# EAGLE design Felderblock_Hebelplatine (EAGLE 7.7.0)
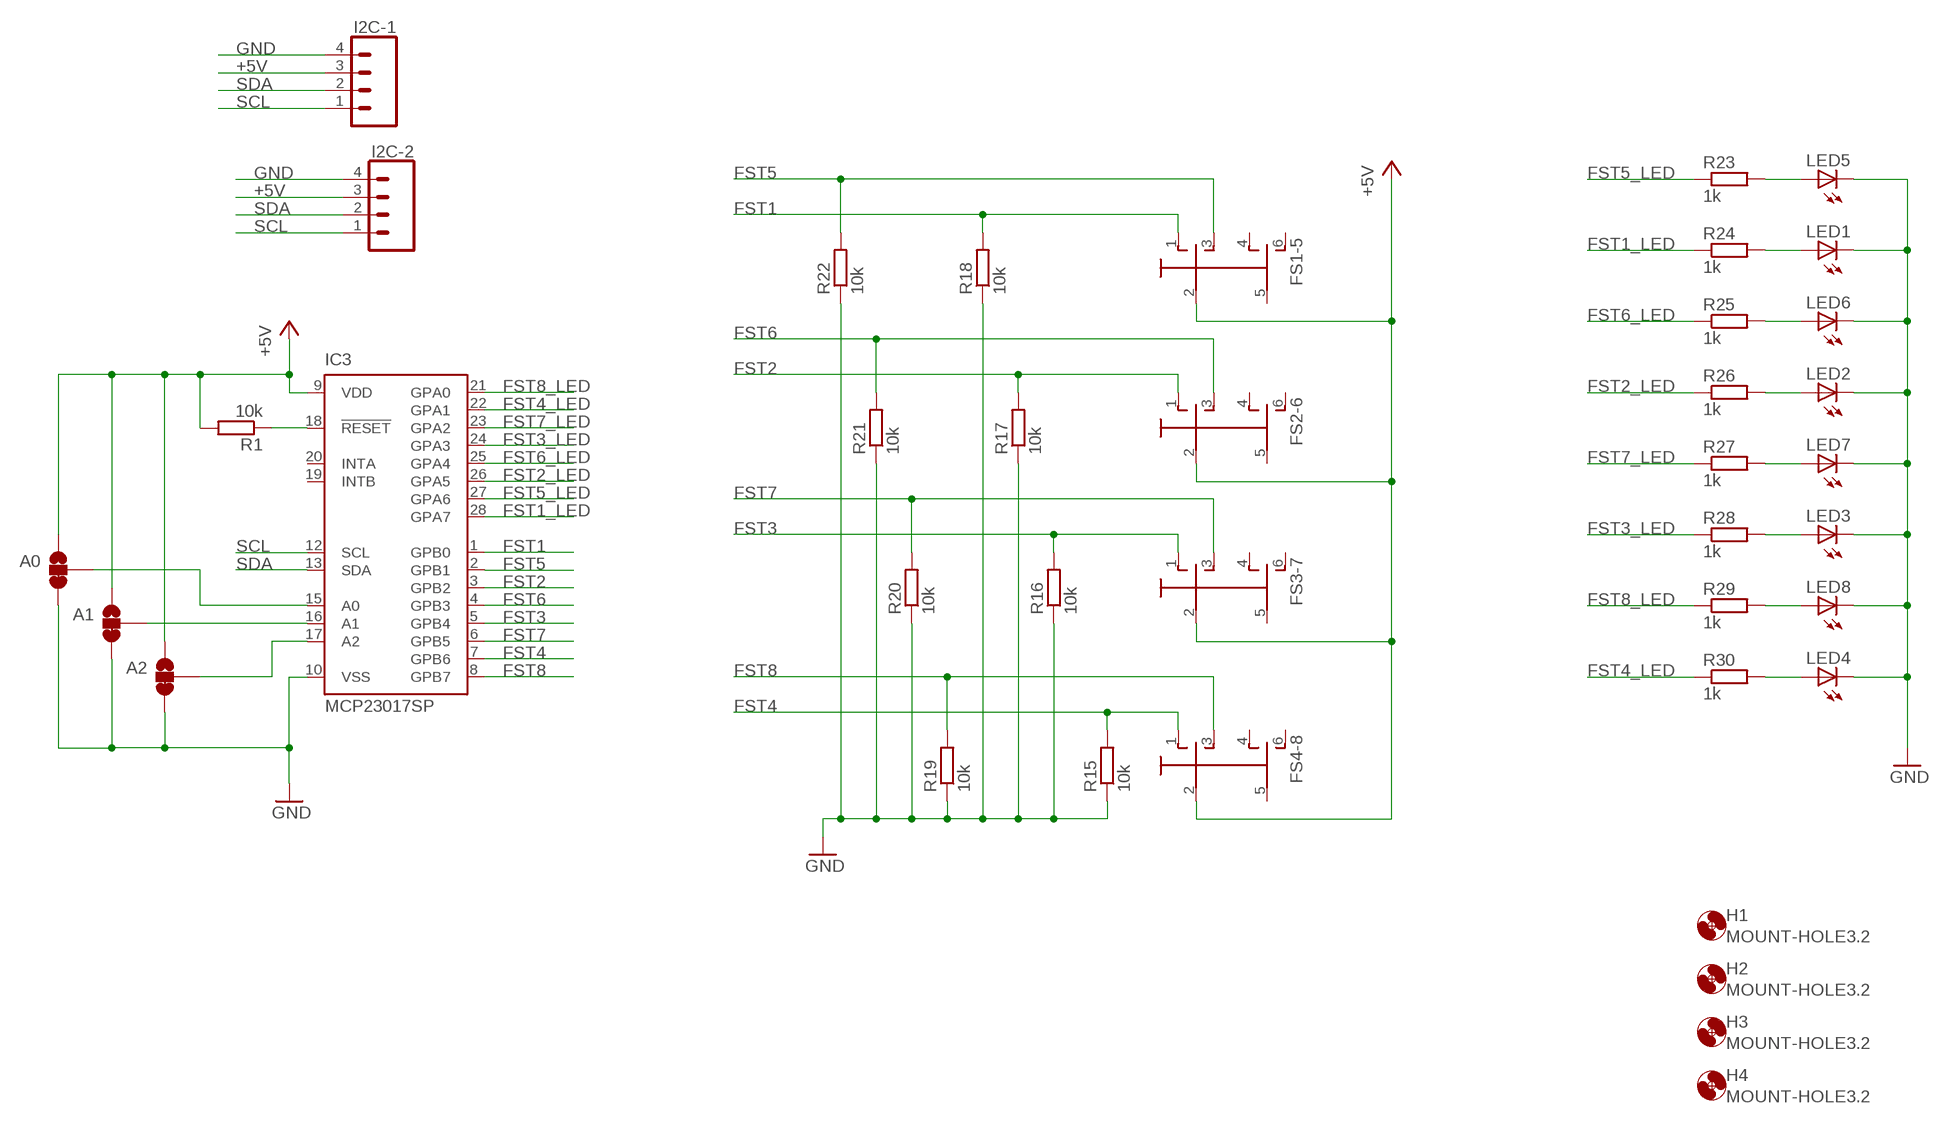
[diagram p0: schematic, sheet 1]

## Parts
A0  JUMPER-SMT_3_1-NC_TRACE_SILK  [SMT-JUMPER_3_1-NC_TRACE_SILK]
A1  JUMPER-SMT_3_1-NC_TRACE_SILK  [SMT-JUMPER_3_1-NC_TRACE_SILK]
A2  JUMPER-SMT_3_1-NC_TRACE_SILK  [SMT-JUMPER_3_1-NC_TRACE_SILK]
FS1-5  SW_2POL_ON-OFF-ONSOLDERPAD  [DIL6_LARGE]
FS2-6  SW_2POL_ON-OFF-ONSOLDERPAD  [DIL6_LARGE]
FS3-7  SW_2POL_ON-OFF-ONSOLDERPAD  [DIL6_LARGE]
FS4-8  SW_2POL_ON-OFF-ONSOLDERPAD  [DIL6_LARGE]
H1  MOUNT-HOLE3.2  [3,2]
H2  MOUNT-HOLE3.2  [3,2]
H3  MOUNT-HOLE3.2  [3,2]
H4  MOUNT-HOLE3.2  [3,2]
I2C-1  CONN_04JST-PTH-VERT  [JST-4-PTH-VERT]
I2C-2  CONN_04JST-PTH-VERT  [JST-4-PTH-VERT]
IC3  MCP23017SP  [DIL28-3]
LED1  LED3MM  [LED3MM]
LED2  LED3MM  [LED3MM]
LED3  LED3MM  [LED3MM]
LED4  LED3MM  [LED3MM]
LED5  LED3MM  [LED3MM]
LED6  LED3MM  [LED3MM]
LED7  LED3MM  [LED3MM]
LED8  LED3MM  [LED3MM]
R1  10k  R-EU_0207/7  [0207/7]
R15  10k  R-EU_0207/7  [0207/7]
R16  10k  R-EU_0207/7  [0207/7]
R17  10k  R-EU_0207/7  [0207/7]
R18  10k  R-EU_0207/7  [0207/7]
R19  10k  R-EU_0207/7  [0207/7]
R20  10k  R-EU_0207/7  [0207/7]
R21  10k  R-EU_0207/7  [0207/7]
R22  10k  R-EU_0207/7  [0207/7]
R23  1k  R-EU_0207/7  [0207/7]
R24  1k  R-EU_0207/7  [0207/7]
R25  1k  R-EU_0207/7  [0207/7]
R26  1k  R-EU_0207/7  [0207/7]
R27  1k  R-EU_0207/7  [0207/7]
R28  1k  R-EU_0207/7  [0207/7]
R29  1k  R-EU_0207/7  [0207/7]
R30  1k  R-EU_0207/7  [0207/7]

## Nets
+5V: A0.1 A1.1 A2.1 FS1-5.2(P) FS2-6.2(P) FS3-7.2(P) FS4-8.2(P) I2C-1.3 I2C-2.3 IC3.9(VDD) R1.2
FST1: FS1-5.1(O) IC3.1(GPB0) R18.2
FST1_LED: IC3.28(GPA7) R24.1
FST2: FS2-6.1(O) IC3.3(GPB2) R17.2
FST2_LED: IC3.26(GPA5) R26.1
FST3: FS3-7.1(O) IC3.5(GPB4) R16.2
FST3_LED: IC3.24(GPA3) R28.1
FST4: FS4-8.1(O) IC3.7(GPB6) R15.2
FST4_LED: IC3.22(GPA1) R30.1
FST5: FS1-5.3(S) IC3.2(GPB1) R22.2
FST5_LED: IC3.27(GPA6) R23.1
FST6: FS2-6.3(S) IC3.4(GPB3) R21.2
FST6_LED: IC3.25(GPA4) R25.1
FST7: FS3-7.3(S) IC3.6(GPB5) R20.2
FST7_LED: IC3.23(GPA2) R27.1
FST8: FS4-8.3(S) IC3.8(GPB7) R19.2
FST8_LED: IC3.21(GPA0) R29.1
GND: A0.3 A1.3 A2.3 I2C-1.4 I2C-2.4 IC3.10(VSS) LED1.K(C) LED2.K(C) LED3.K(C) LED4.K(C) LED5.K(C) LED6.K(C) LED7.K(C) LED8.K(C) R15.1 R16.1 R17.1 R18.1 R19.1 R20.1 R21.1 R22.1
N$1: A0.2 IC3.15(A0)
N$2: A2.2 IC3.17(A2)
N$3: A1.2 IC3.16(A1)
N$4: IC3.18(!RESET) R1.1
N$10: LED5.A R23.2
N$11: LED1.A R24.2
N$12: LED6.A R25.2
N$13: LED2.A R26.2
N$14: LED7.A R27.2
N$15: LED3.A R28.2
N$16: LED8.A R29.2
N$17: LED4.A R30.2
SCL: I2C-1.1 I2C-2.1 IC3.12(SCL)
SDA: I2C-1.2 I2C-2.2 IC3.13(SDA)
Unconnected: FS1-5.4(O1) FS1-5.5(P1) FS1-5.6(S1) FS2-6.4(O1) FS2-6.5(P1) FS2-6.6(S1) FS3-7.4(O1) FS3-7.5(P1) FS3-7.6(S1) FS4-8.4(O1) FS4-8.5(P1) FS4-8.6(S1) IC3.19(INTB) IC3.20(INTA)

## Library data of the parts
A0 A1 A2 = SparkFun-Jumpers:JUMPER-SMT_3_1-NC_TRACE: Normally closed trace jumper (1 of 2 connections) This jumper has a trace between two pads so it's normally closed (NC). The other connection is normally open (NO). Use a razor knife to open the connection. For best results follow the IPC guidelines for cutting traces: Cutout at least 0.063 mm (0.005 in). Remove all loose material to clean up the cut area. Seal the cut with an approved epoxy. Reapply solder to reclose the connection, or to close the NO connection.
FS1-5 FS2-6 FS3-7 FS4-8 = Jens:SW_2POL_ON-OFF-ON: 2poliger Umschalter mit Mittelstellung (on-off-on)
H1-H4 = holes:MOUNT-HOLE: MOUNTING HOLE with drill center marker
I2C-1 I2C-2 = SparkFun-Connectors:CONN_04: Multi connection point. Often used as Generic Header-pin footprint for 0.1 inch spaced/style header connections On any of the 0.1 inch spaced packages, you can populate with these: Break Away Headers - Straight <https://www.sparkfun.com/products/116> (PRT-00116) Break Away Male Headers - Right Angle <https://www.sparkfun.com/products/553> (PRT-00553) Female Headers <https://www.sparkfun.com/products/115> (PRT-00115) Break Away Headers - Machine Pin <https://www.sparkfun.com/products/117> (PRT-00117) Break Away Female Headers - Swiss Machine Pin <https://www.sparkfun.com/products/743> (PRT-00743) For SCREWTERMINALS and SPRING TERMINALS visit here: Screw Terimnals on SparkFun.com <https://www.sparkfun.com/search/results?term=Screw+Terminals> (5mm/3.5mm/2.54mm spacing) This device is also useful as a general connection point to wire up your design to another part of your project. Our various solder wires solder well into these plated through hole pads. Hook-Up Wire - Assortment (Stranded, 22 AWG) <https://www.sparkfun.com/products/11375> (PRT-11375) Hook-Up Wire - Assortment (Solid Core, 22 AWG) <https://www.sparkfun.com/products/11367> (PRT-11367) View the entire wire category on our website here <https://www.sparkfun.com/categories/141> Special notes: Molex polarized connector foot print use with SKU : PRT-08231 with associated crimp pins and housings. 1MM SMD Version SKU: PRT-10208; PROD_ID: CONN-13251
IC3 = microchip:MCP23017: http://ww1.microchip.com/downloads/en/DeviceDoc/21952a.pdf Source: http://ww1.microchip.com/downloads/en/DeviceDoc/21952a.pdf; MF: MICROCHIP; MPN: MCP23017-E/SP; OC_FARNELL: 1332088; OC_NEWARK: 31K2959
LED1-LED8 = SparkFun-LED:LED: LEDs Standard schematic elements and footprints for 5mm, 3mm, 1206, and 0603 sized LEDs. 5mm - Spark Fun Electronics SKU : COM-00529 (and others)
R1 R15-R30 = resistor:R-EU_: RESISTOR, European symbol

## Board
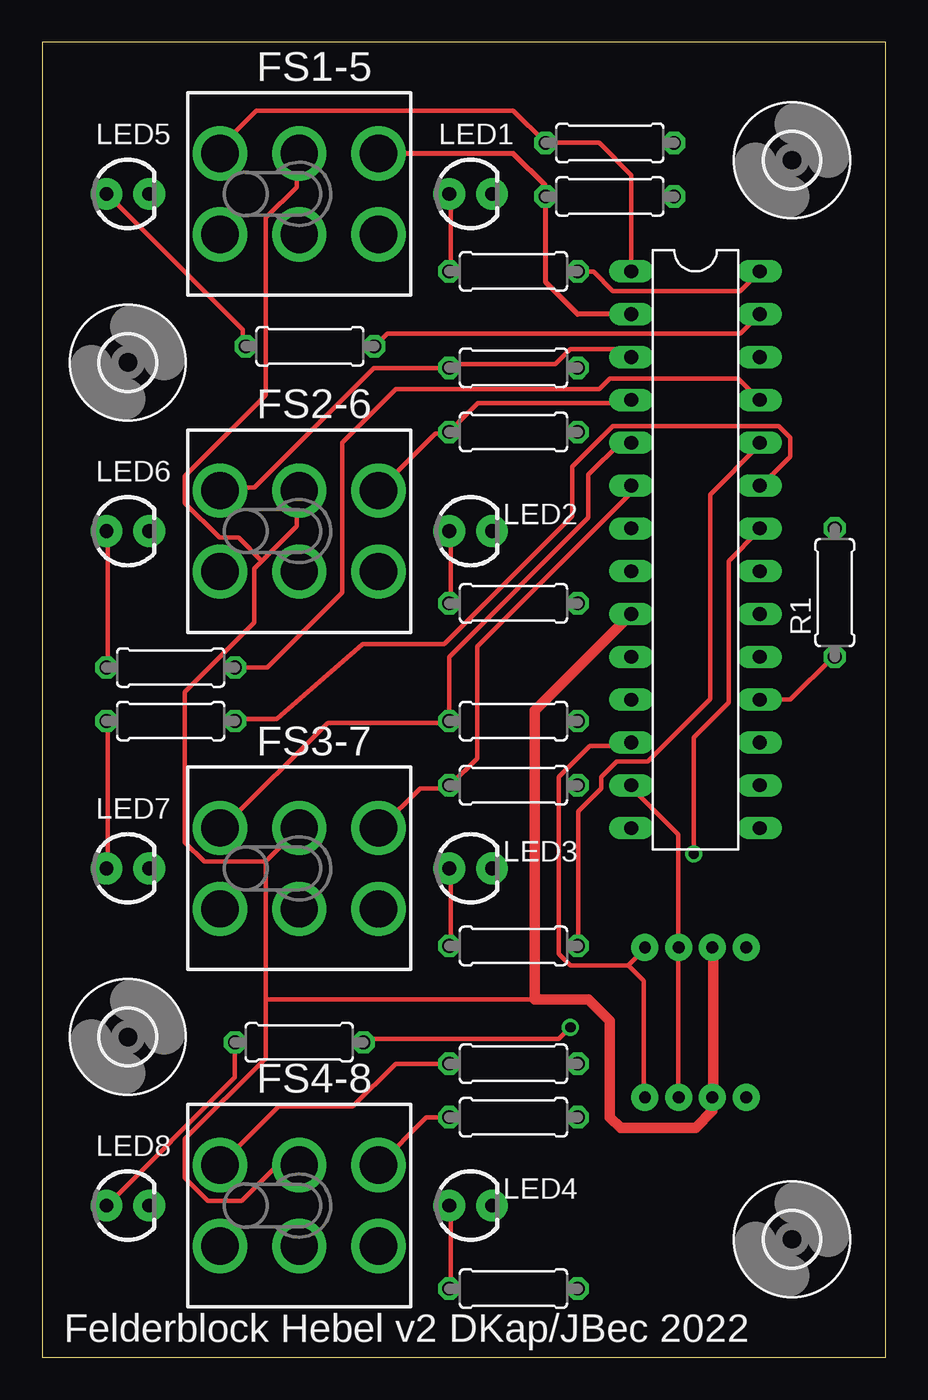
[diagram p1: board, top side]
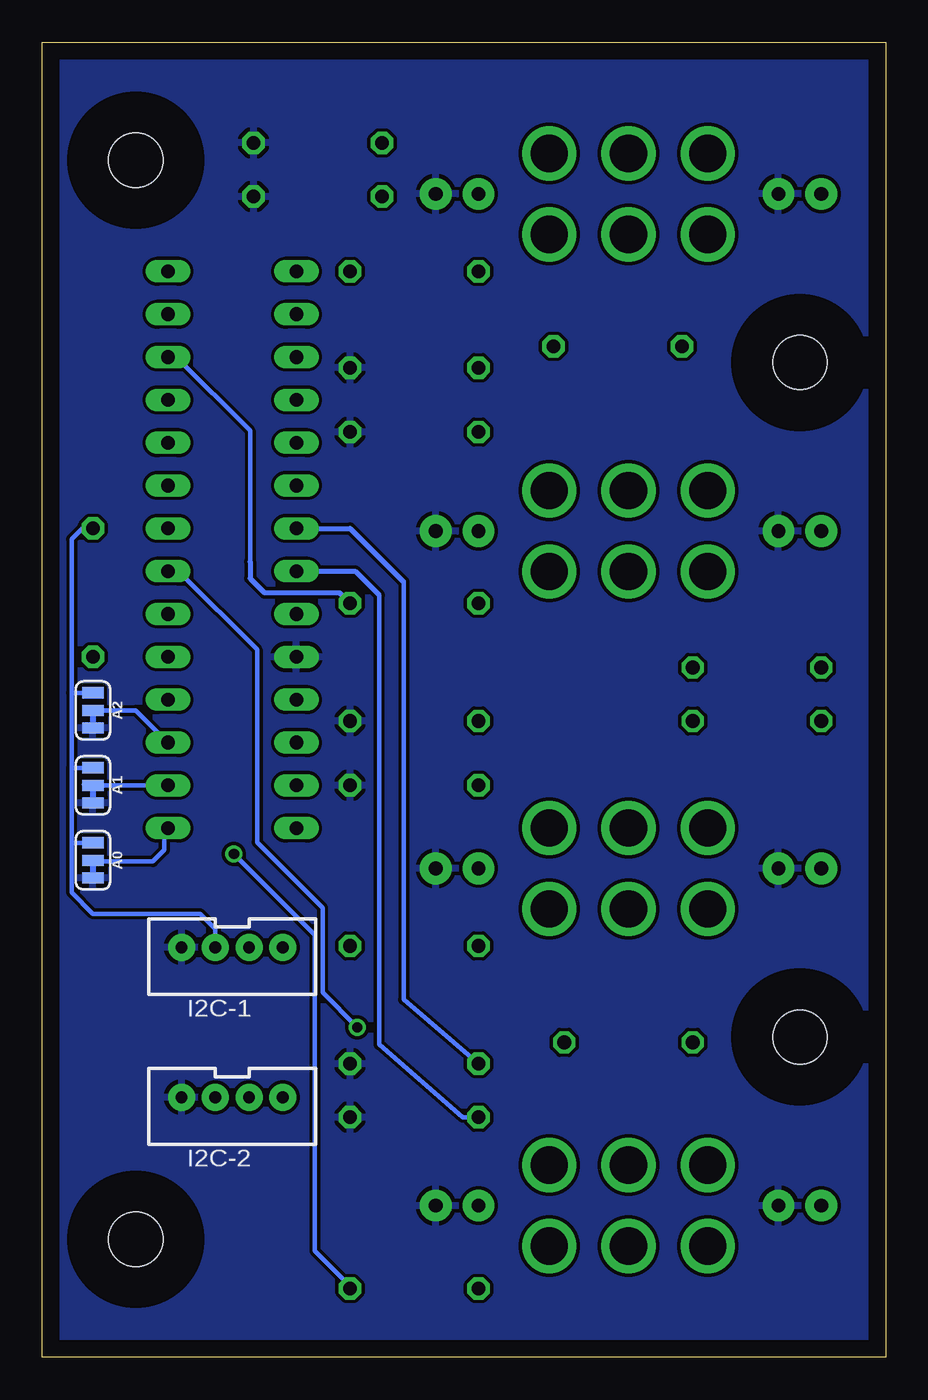
[diagram p2: board, bottom side, seen from below]

Size 50 x 78 mm. Coordinates in mm from the lower left corner, seen from the top.
Outline: 0,0 50,0 50,78 0,78 0,0
Copper layers (1*16): Top 0.035mm / dielectric 1.5mm / Bottom 0.035mm
Design rules "default": minimum track width 10mil, minimum drill 24mil, track to track 8mil, track to pad 8mil, pad to pad 8mil, via to via 8mil, smd to smd 8mil, copper to edge 40mil, drill to drill 8mil, minimum pad ring 10mil, minimum via ring 8mil, stop-mask expansion 4mil, vias tented up to drill 0mil, thermal gap 10mil

### Footprints (pad centres in the part's own frame; a part is rotated, then mirrored left to right if it is on the bottom)
SMT-JUMPER_3_1-NC_TRACE_SILK = smd 0.66 x 1.27: 1 -1.041,0; 2 0,0; 3 1.041,0
DIL6_LARGE = drill 2.2 pad 2.54: 1 -4.7,2.4; 2 0,2.4; 3 4.7,2.4; 4 -4.7,-2.4; 5 0,-2.4; 6 4.7,-2.4
3,2 = hole 3.2: 0,0
JST-4-PTH-VERT = drill 0.7 pad 1.6: 1 -3,-0.55; 2 -1,-0.55; 3 1,-0.55; 4 3,-0.55
DIL28-3 = drill 0.813 long: 1 -16.51,-3.81; 2 -13.97,-3.81; 3 -11.43,-3.81; 4 -8.89,-3.81; 5 -6.35,-3.81; 6 -3.81,-3.81; 7 -1.27,-3.81; 8 1.27,-3.81; 9 3.81,-3.81; 10 6.35,-3.81; 11 8.89,-3.81; 12 11.43,-3.81; 13 13.97,-3.81; 14 16.51,-3.81; 15 16.51,3.81; 16 13.97,3.81; 17 11.43,3.81; 18 8.89,3.81; 19 6.35,3.81; 20 3.81,3.81; 21 1.27,3.81; 22 -1.27,3.81; 23 -3.81,3.81; 24 -6.35,3.81; 25 -8.89,3.81; 26 -11.43,3.81; 27 -13.97,3.81; 28 -16.51,3.81
LED3MM = drill 0.813 pad 1.88: A -1.27,0; K 1.27,0
0207/7 = drill 0.813 octagon: 1 -3.81,0; 2 3.81,0

### Placement (x,y rotation side)
A0  46.99,29.48 270 bottom
A1  46.99,33.92 270 bottom
A2  46.99,38.37 270 bottom
FS1-5  15.24,69 0 top
FS2-6  15.24,49 0 top
FS3-7  15.24,29 0 top
FS4-8  15.24,9 0 top
H1  44.45,71 0 top
H2  44.45,7 0 top
H3  5.08,19 0 top
H4  5.08,59 0 top
I2C-1  38.73,23.77 180 bottom
I2C-2  38.73,14.88 180 bottom
IC3  38.73,47.9 270 top
LED1  25.4,69 0 top
LED2  25.4,49 0 top
LED3  25.4,29 0 top
LED4  25.4,9 0 top
LED5  5.08,69 0 top
LED6  5.08,49 0 top
LED7  5.08,29 0 top
LED8  5.08,9 0 top
R1  46.99,45.35 90 top
R15  27.94,17.41 180 top
R16  27.94,37.73 180 top
R17  27.94,58.69 180 top
R18  33.66,72.03 180 top
R19  27.94,14.24 180 top
R20  27.94,33.92 180 top
R21  27.94,54.88 180 top
R22  33.66,68.85 180 top
R23  15.88,59.96 180 top
R24  27.94,64.41 180 top
R25  7.62,40.91 180 top
R26  27.94,44.72 180 top
R27  7.62,37.73 180 top
R28  27.94,24.4 180 top
R29  15.24,18.68 180 top
R30  27.94,4.08 180 top

### Tracks (layer width: path | path; a pad name or v marks a point on that pad's centre or on a via)
+5V
  Top 0.254: 13.26,29.4 13.26,21.23 | 13.26,21.23 13.26,17.75 8.46,12.95 8.46,10.66 9.83,9.29 11.84,9.29 13.89,11.34 15.09,11.34 FS4-8.2 | 13.26,29.4 15.09,31.23 FS3-7.2 | 13.03,47.23 12.57,46.78 12.57,43.58 8.46,39.46 8.46,30.55 9.6,29.4 13.26,29.4 | 13.03,47.23 15.09,49.29 15.09,51.35 FS2-6.2 | 13.03,47.23 11.66,48.61 10.52,48.61 8.46,50.66 8.46,52.26 13.26,57.06 13.26,67.58 15.09,69.41 15.09,71.24 FS1-5.2 | 39.55,15.23 I2C-2.3 39.78,15.46 | 29.21,21.23 13.26,21.23 | 39.78,24.15 I2C-1.3
  Top 0.61: IC3.9 29.21,38.37 29.21,21.23 32.38,21.23 33.66,19.95 33.66,14.24 34.29,13.61 38.73,13.61 39.73,14.61 I2C-2.3 | 39.78,15.46 39.78,24.15
  Bottom 0.254: I2C-1.3 39.73,25.4 40.64,26.3 46.99,26.3 48.26,27.57 48.26,30.52 | 48.26,30.52 48.26,34.97 | A0.1 48.26,30.52 | A1.1 48.26,34.97 | R1.2 47.62,49.16 48.26,48.53 48.26,39.41 | 48.26,39.41 48.26,34.97 | A2.1 48.26,39.41
FST1
  Top 0.254: IC3.1 34.92,70.12 33.02,72.03 R18.2 27.94,73.93 12.7,73.93 10.54,71.77 FS1-5.1
FST1_LED
  Top 0.254: IC3.28 41.38,63.24 33.83,63.24 32.69,64.38 31.77,64.38 R24.1
FST2
  Top 0.254: IC3.3 34.75,59.35 34.29,59.81 31.32,59.81 30.4,58.89 24.23,58.89 R17.2 24,58.66 19.66,58.66 12.57,51.58 10.74,51.58 FS2-6.1
FST2_LED
  Bottom 0.254: 37.67,47.18 37.67,54.96 42.04,59.33 IC3.26
  Bottom 0.305: 37.67,47.18 37.67,46.19 36.83,45.35 32.38,45.35 R26.1
FST3
  Top 0.254: FS3-7.1 10.74,31.46 16.92,37.63 24,37.63 R16.2 24.13,41.55 32.38,49.8 32.38,52.34 34.29,54.24 IC3.5
FST3_LED
  Top 0.254: R28.1 31.77,24.6 31.77,32.38 33.15,33.75 33.15,34.43 34.06,35.35 35.89,35.35 39.6,39.06 39.6,51.17 42.52,54.09 IC3.24
FST4
  Top 0.254: R15.2 20.95,17.41 18.41,14.88 14.02,14.88 FS4-8.1
  Bottom 0.254: 28.57,45.99 28.57,21.23 R15.2
  Bottom 0.305: IC3.7 31.75,49.16 28.57,45.99
FST4_LED  (via drill 0.61)
  Top 0.254: v38.63,29.86 38.63,36.77 40.69,38.83 40.69,47.23 42.52,49.06 IC3.22
  Bottom 0.254: v38.63,29.86 33.83,25.06 33.83,6.32 31.77,4.26 R30.1
FST5
  Top 0.305: IC3.2 31.75,61.87 29.84,63.77 R22.2 29.84,69.48 27.94,71.39 FS1-5.3
FST5_LED
  Top 0.254: IC3.27 42.52,61.87 41.38,60.72 20.45,60.72 R23.1
FST6
  Top 0.254: FS2-6.3 20.12,51.58 23.32,54.78 24,54.78 R21.2 24.23,55.01 25.83,56.61 34.75,56.61 IC3.4
FST6_LED
  Top 0.254: IC3.25 41.27,58.05 33.66,58.05 33.02,57.42 20.95,57.42 17.78,54.24 17.78,45.35 13.34,40.91 R25.1
FST7
  Top 0.254: FS3-7.3 20.12,31.46 22.4,33.75 24,33.75 R20.2 24.23,33.98 25.78,35.52 25.78,42.16 34.75,51.12 34.75,51.58 IC3.6
FST7_LED
  Top 0.254: R27.1 11.43,37.86 13.92,37.86 19,42.31 23.82,42.31 31.42,49.9 31.42,52.82 33.83,55.24 43.66,55.24 44.35,54.55 44.35,53.41 42.75,51.81 IC3.23
FST8
  Top 0.254: R19.2 22.78,14.24 FS4-8.3
  Bottom 0.254: 30.02,45.2 30.02,18.56 25.07,14.24 R19.2
  Bottom 0.305: IC3.8 31.45,46.62 30.02,45.2
FST8_LED  (via drill 0.61)
  Top 0.254: v31.32,19.57 30.63,18.89 19.2,18.89 R29.1
  Bottom 0.254: v31.32,19.57 33.38,21.63 33.38,26.66 37.26,30.55 37.26,41.98 41.83,46.55 42.52,46.55 IC3.21
GND
  pour Bottom: 0,0 50.8,0 50.8,78 0,78
N$1
  Bottom 0.254: A0.2 46.86,29.4 43.43,29.4 42.75,30.09 42.75,31.23 IC3.15
N$2
  Bottom 0.254: A2.2 44.45,38.37 IC3.17
N$3
  Bottom 0.254: 47.55,33.98 47.09,33.98 A1.2 IC3.16
N$4
  Top 0.254: IC3.18 44.35,39.01 46.86,41.52 R1.1
N$10
  Top 0.254: R23.2 11.89,60.04 11.89,60.95 3.89,68.95 LED5.A
N$11
  Top 0.254: R24.2 24.23,64.61 24.23,68.95 LED1.A
N$12
  Top 0.254: R25.2 3.89,41.06 3.89,48.84 LED6.A
N$13
  Top 0.254: R26.2 24.23,44.72 24.23,48.84 LED2.A
N$14
  Top 0.254: R27.2 3.89,37.63 3.89,29.18 LED7.A
N$15
  Top 0.254: R28.2 24.23,24.6 24.23,28.95 LED3.A
N$16
  Top 0.254: R29.2 11.43,16.6 3.89,9.06 LED8.A
N$17
  Top 0.254: R30.2 24.23,4.26 24.23,8.83 LED4.A
SCL
  Top 0.254: 34.75,23.23 31.32,23.23 30.63,23.92 30.63,34.43 32.46,36.26 34.75,36.26 IC3.12 | 34.75,23.23 35.66,24.15 I2C-1.1 | 34.75,23.23 35.66,22.32 35.66,15.46 I2C-2.1
SDA
  Top 0.254: IC3.13 34.98,33.75 37.72,31 37.72,24.38 I2C-1.2 37.72,24.15 37.72,15.46 I2C-2.2

### Text on the board
tNames: Felderblock Hebel v2 DKap/JBec 2022